# EAGLE design stm32f4discovery-daugherboard (EAGLE 6.2)
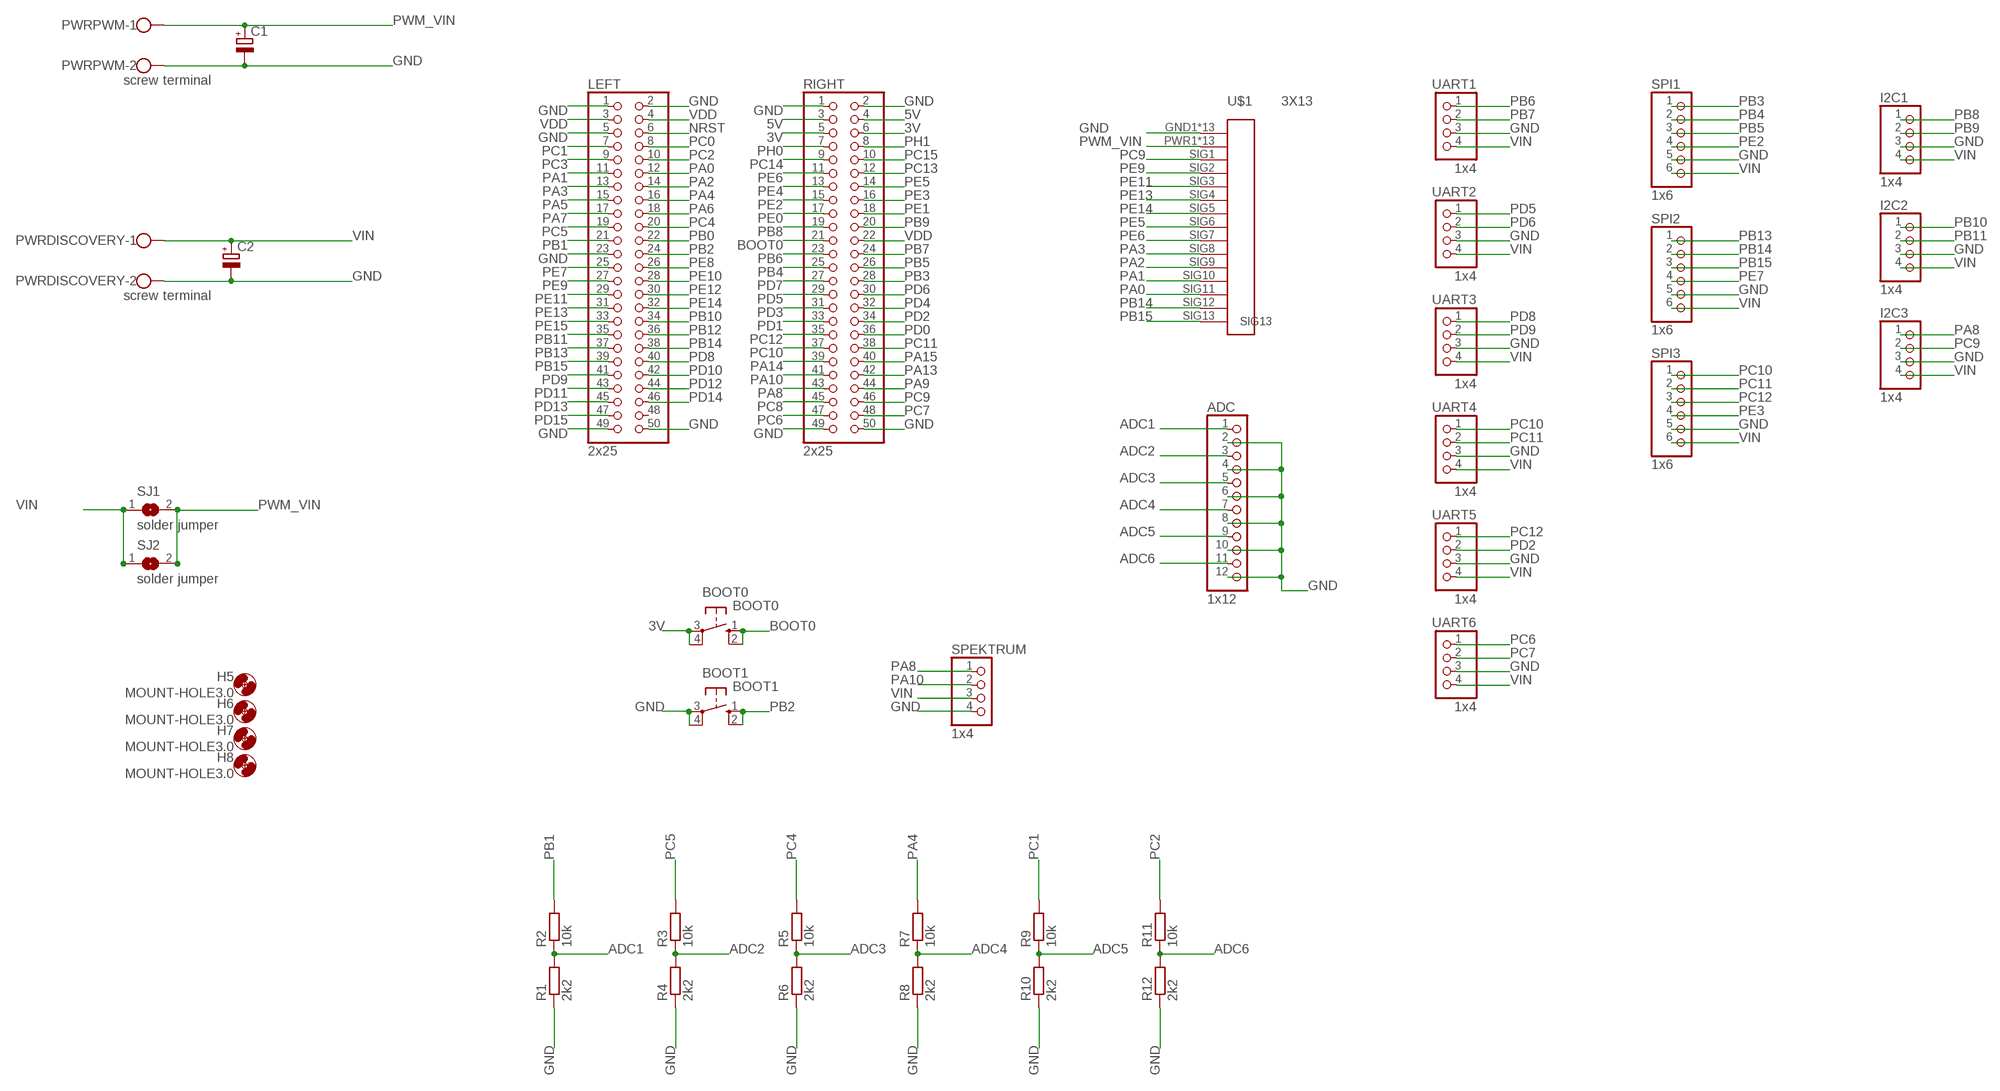
[diagram p0: schematic, sheet 1]

## Parts
ADC  1x12  PINHD-1X12/90  [1X12/90]
BOOT0  BOOT0  10-XX  [B3F-10XX]
BOOT1  BOOT1  10-XX  [B3F-10XX]
C1  CPOL-EU153CLV-0807  [153CLV-0807]
C2  CPOL-EU153CLV-0807  [153CLV-0807]
H5  MOUNT-HOLE3.0  [3,0]
H6  MOUNT-HOLE3.0  [3,0]
H7  MOUNT-HOLE3.0  [3,0]
H8  MOUNT-HOLE3.0  [3,0]
I2C1  1x4  PINHD-1X4/90  [1X04/90]
I2C2  1x4  PINHD-1X4/90  [1X04/90]
I2C3  1x4  PINHD-1X4/90  [1X04/90]
LEFT  2x25  PINHD-2X25  [2X25]
PWRDISCOVERY  screw terminal  W237-102  [W237-102]
PWRPWM  screw terminal  W237-102  [W237-102]
R1  2k2  R-EU_M0805  [M0805]
R2  10k  R-EU_M0805  [M0805]
R3  10k  R-EU_M0805  [M0805]
R4  2k2  R-EU_M0805  [M0805]
R5  10k  R-EU_M0805  [M0805]
R6  2k2  R-EU_M0805  [M0805]
R7  10k  R-EU_M0805  [M0805]
R8  2k2  R-EU_M0805  [M0805]
R9  10k  R-EU_M0805  [M0805]
R10  2k2  R-EU_M0805  [M0805]
R11  10k  R-EU_M0805  [M0805]
R12  2k2  R-EU_M0805  [M0805]
RIGHT  2x25  PINHD-2X25  [2X25]
SJ1  solder jumper  SJW  [SJW]
SJ2  solder jumper  SJW  [SJW]
SPEKTRUM  1x4  PINHD-1X4/90  [1X04/90]
SPI1  1x6  PINHD-1X6/90  [1X06/90]
SPI2  1x6  PINHD-1X6/90  [1X06/90]
SPI3  1x6  PINHD-1X6/90  [1X06/90]
U$1  3X13  [3X13]
UART1  1x4  PINHD-1X4/90  [1X04/90]
UART2  1x4  PINHD-1X4/90  [1X04/90]
UART3  1x4  PINHD-1X4/90  [1X04/90]
UART4  1x4  PINHD-1X4/90  [1X04/90]
UART5  1x4  PINHD-1X4/90  [1X04/90]
UART6  1x4  PINHD-1X4/90  [1X04/90]

## Nets
3V: BOOT0.3(P) BOOT0.4(P1) RIGHT.5 RIGHT.6
5V: RIGHT.3 RIGHT.4
ADC1: ADC.1 R1.2 R2.1
ADC2: ADC.3 R3.1 R4.2
ADC3: ADC.5 R5.1 R6.2
ADC4: ADC.7 R7.1 R8.2
ADC5: ADC.9 R9.1 R10.2
ADC6: ADC.11 R11.1 R12.2
BOOT0: BOOT0.1(S) BOOT0.2(S1) RIGHT.21
GND: ADC.2 ADC.4 ADC.6 ADC.8 ADC.10 ADC.12 BOOT1.3(P) BOOT1.4(P1) C1.- C2.- I2C1.3 I2C2.3 I2C3.3 LEFT.1 LEFT.2 LEFT.5 LEFT.23 LEFT.49 LEFT.50 PWRDISCOVERY.2 PWRPWM.2 R1.1 R4.1 R6.1 R8.1 R10.1 R12.1 RIGHT.1 RIGHT.2 RIGHT.49 RIGHT.50 SPEKTRUM.4 SPI1.5 SPI2.5 SPI3.5 U$1.GND1(GND) U$1.GND2(GND) U$1.GND3(GND) U$1.GND4(GND) U$1.GND5(GND) U$1.GND6(GND) U$1.GND7(GND) U$1.GND8(GND) U$1.GND9(GND) U$1.GND10(GND) U$1.GND11(GND) U$1.GND12(GND) U$1.GND13(GND) UART1.3 UART2.3 UART3.3 UART4.3 UART5.3 UART6.3
NRST: LEFT.6
PA0: LEFT.12 U$1.SIG11
PA1: LEFT.11 U$1.SIG10
PA2: LEFT.14 U$1.SIG9
PA3: LEFT.13 U$1.SIG8
PA4: LEFT.16 R7.2
PA5: LEFT.15
PA6: LEFT.18
PA7: LEFT.17
PA8: I2C3.1 RIGHT.43 SPEKTRUM.1
PA9: RIGHT.44
PA10: RIGHT.41 SPEKTRUM.2
PA13: RIGHT.42
PA14: RIGHT.39
PA15: RIGHT.40
PB0: LEFT.22
PB1: LEFT.21 R2.2
PB2: BOOT1.1(S) BOOT1.2(S1) LEFT.24
PB3: RIGHT.28 SPI1.1
PB4: RIGHT.25 SPI1.2
PB5: RIGHT.26 SPI1.3
PB6: RIGHT.23 UART1.1
PB7: RIGHT.24 UART1.2
PB8: I2C1.1 RIGHT.19
PB9: I2C1.2 RIGHT.20
PB10: I2C2.1 LEFT.34
PB11: I2C2.2 LEFT.35
PB12: LEFT.36
PB13: LEFT.37 SPI2.1
PB14: LEFT.38 SPI2.2 U$1.SIG12
PB15: LEFT.39 SPI2.3 U$1.SIG13
PC0: LEFT.8
PC1: LEFT.7 R9.2
PC2: LEFT.10 R11.2
PC3: LEFT.9
PC4: LEFT.20 R5.2
PC5: LEFT.19 R3.2
PC6: RIGHT.47 UART6.1
PC7: RIGHT.48 UART6.2
PC8: RIGHT.45
PC9: I2C3.2 RIGHT.46 U$1.SIG1
PC10: RIGHT.37 SPI3.1 UART4.1
PC11: RIGHT.38 SPI3.2 UART4.2
PC12: RIGHT.35 SPI3.3 UART5.1
PC13: RIGHT.12
PC14: RIGHT.9
PC15: RIGHT.10
PD0: RIGHT.36
PD1: RIGHT.33
PD2: RIGHT.34 UART5.2
PD3: RIGHT.31
PD4: RIGHT.32
PD5: RIGHT.29 UART2.1
PD6: RIGHT.30 UART2.2
PD7: RIGHT.27
PD8: LEFT.40 UART3.1
PD9: LEFT.41 UART3.2
PD10: LEFT.42
PD11: LEFT.43
PD12: LEFT.44
PD13: LEFT.45
PD14: LEFT.46
PD15: LEFT.47
PE0: RIGHT.17
PE1: RIGHT.18
PE2: RIGHT.15 SPI1.4
PE3: RIGHT.16 SPI3.4
PE4: RIGHT.13
PE5: RIGHT.14 U$1.SIG6
PE6: RIGHT.11 U$1.SIG7
PE7: LEFT.25 SPI2.4
PE8: LEFT.26
PE9: LEFT.27 U$1.SIG2
PE10: LEFT.28
PE11: LEFT.29 U$1.SIG3
PE12: LEFT.30
PE13: LEFT.31 U$1.SIG4
PE14: LEFT.32 U$1.SIG5
PE15: LEFT.33
PH0: RIGHT.7
PH1: RIGHT.8
PWM_VIN: C1.+ PWRPWM.1 SJ1.2 SJ2.2 U$1.PWR1(PWR) U$1.PWR2(PWR) U$1.PWR3(PWR) U$1.PWR4(PWR) U$1.PWR5(PWR) U$1.PWR6(PWR) U$1.PWR7(PWR) U$1.PWR8(PWR) U$1.PWR9(PWR) U$1.PWR10(PWR) U$1.PWR11(PWR) U$1.PWR12(PWR) U$1.PWR13(PWR)
VDD: LEFT.3 LEFT.4 RIGHT.22
VIN: C2.+ I2C1.4 I2C2.4 I2C3.4 PWRDISCOVERY.1 SJ1.1 SJ2.1 SPEKTRUM.3 SPI1.6 SPI2.6 SPI3.6 UART1.4 UART2.4 UART3.4 UART4.4 UART5.4 UART6.4
Unconnected: LEFT.48

## Library data of the parts
ADC = pinhead:PINHD-1X12: PIN HEADER
BOOT0 BOOT1 = switch-omron:10-XX: OMRON SWITCH; MPN: B3F-1000; OC_FARNELL: 176432; OC_NEWARK: 36M3542
C1 C2 = rcl:CPOL-EU: POLARIZED CAPACITOR, European symbol
H5-H8 = holes:MOUNT-HOLE: MOUNTING HOLE with drill center marker
I2C1-I2C3 SPEKTRUM UART1-UART6 = pinhead:PINHD-1X4: PIN HEADER
LEFT RIGHT = pinhead:PINHD-2X25: PIN HEADER
PWRDISCOVERY PWRPWM = con-wago-500:W237-102: WAGO SCREW CLAMP; MPN: 237-102; OC_FARNELL: unknown; OC_NEWARK: 70K9898
R1-R12 = resistor:R-EU_: RESISTOR, European symbol
SJ1 SJ2 = jumper:SJ: SMD solder JUMPER
SPI1-SPI3 = pinhead:PINHD-1X6: PIN HEADER
U$1 = pinhead3:3X13

## Board
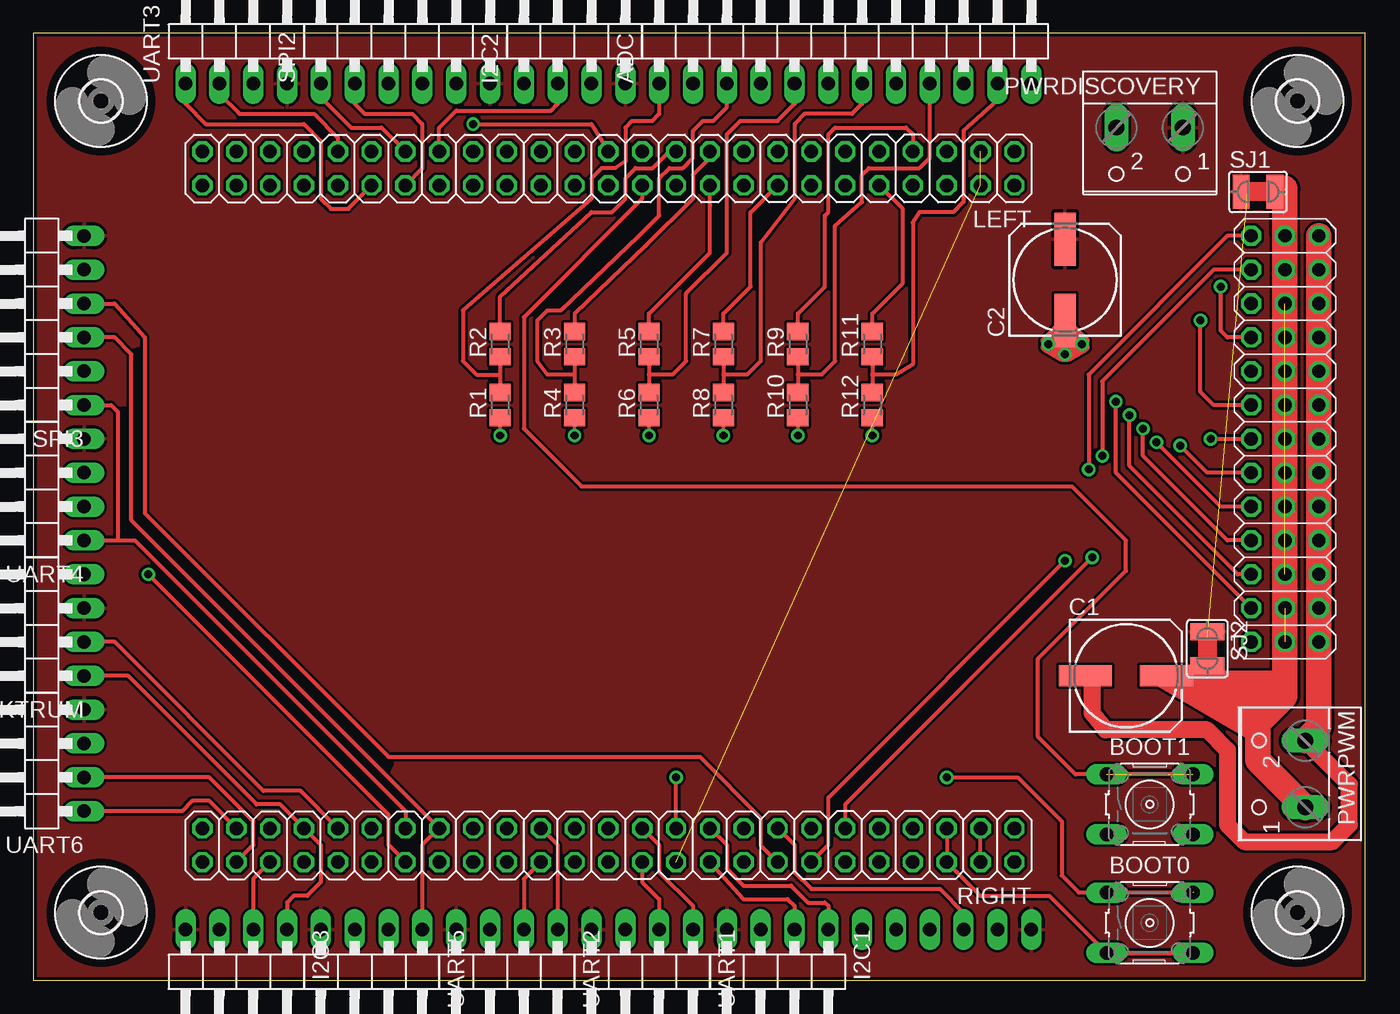
[diagram p1: board, top side]
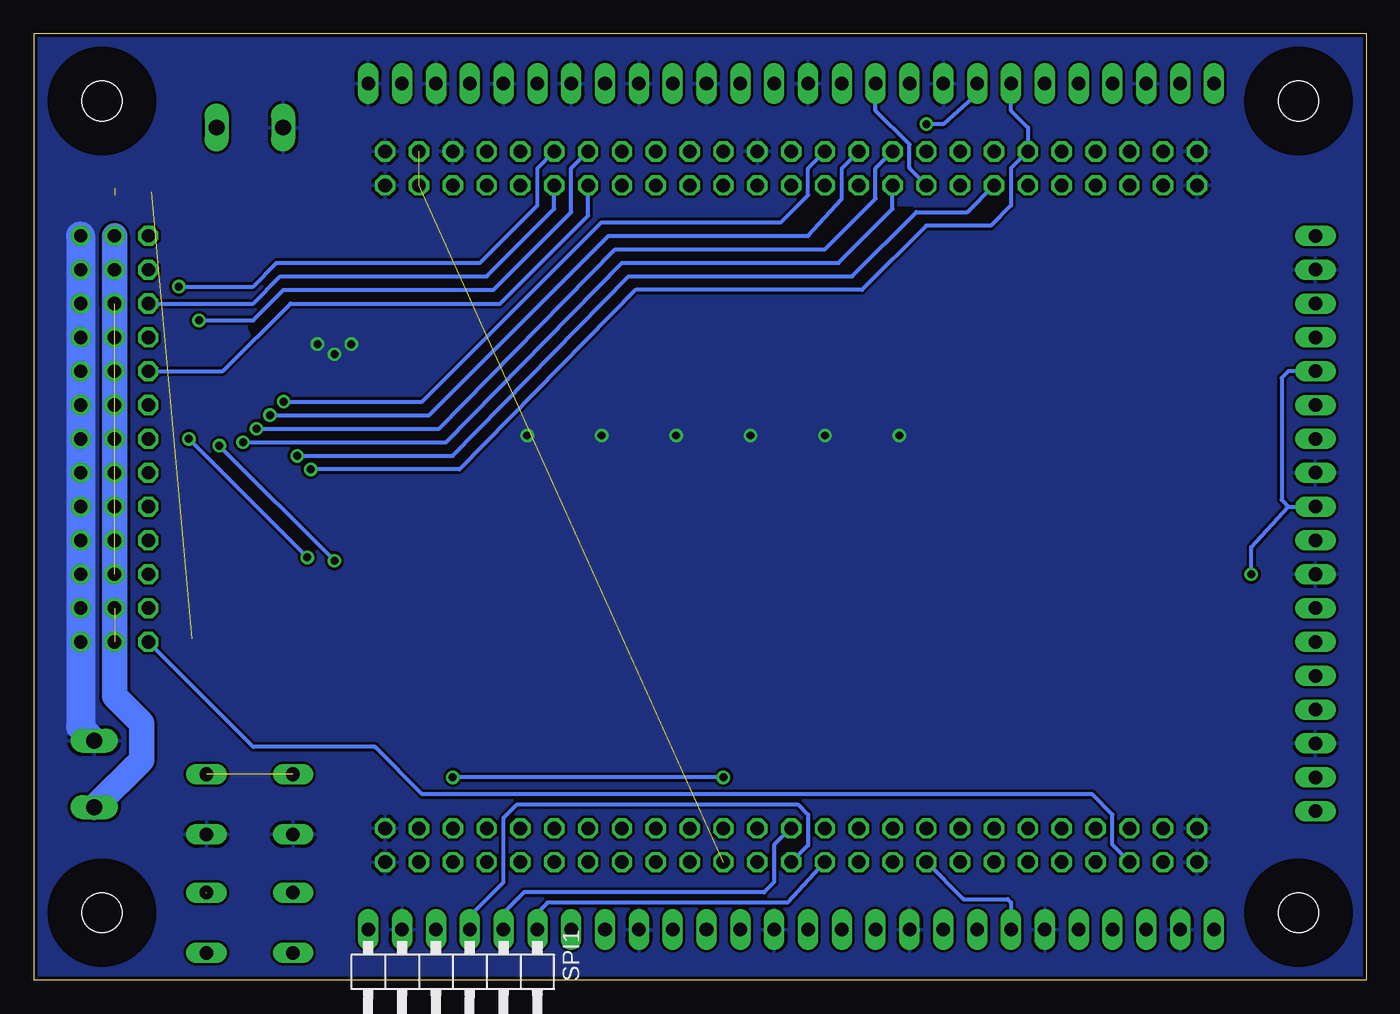
[diagram p2: board, bottom side, seen from below]

Size 100 x 71.08 mm. Coordinates in mm from the lower left corner, seen from the top.
Outline: 0,0 100,0 100,71.08 0,71.08 0,0
Copper layers (1*16): Top 0.035mm / dielectric 1.5mm / Bottom 0.035mm
Design rules: minimum track width 10mil, minimum drill 24mil, track to track 8mil, track to pad 8mil, pad to pad 8mil, via to via 8mil, smd to smd 8mil, copper to edge 10mil, drill to drill 8mil, minimum pad ring 10mil, minimum via ring 8mil, stop-mask expansion 4mil, vias tented up to drill 0mil, thermal gap 10mil

### Footprints (pad centres in the part's own frame; a part is rotated, then mirrored left to right if it is on the bottom)
1X12/90 = drill 1.016 long: 1 -13.97,-3.81; 2 -11.43,-3.81; 3 -8.89,-3.81; 4 -6.35,-3.81; 5 -3.81,-3.81; 6 -1.27,-3.81; 7 1.27,-3.81; 8 3.81,-3.81; 9 6.35,-3.81; 10 8.89,-3.81; 11 11.43,-3.81; 12 13.97,-3.81
B3F-10XX = drill 1.016 long: 1 -3.251,2.261; 2 3.251,2.261; 3 -3.251,-2.261; 4 3.251,-2.261
153CLV-0807 = smd 4 x 1.6: + 3.05,0; - -3.05,0
3,0 = hole 3: 0,0
1X04/90 = drill 1.016 long: 1 -3.81,-3.81; 2 -1.27,-3.81; 3 1.27,-3.81; 4 3.81,-3.81
2X25 = drill 1.016 octagon: 1 -30.48,-1.27; 2 -30.48,1.27; 3 -27.94,-1.27; 4 -27.94,1.27; 5 -25.4,-1.27; 6 -25.4,1.27; 7 -22.86,-1.27; 8 -22.86,1.27; 9 -20.32,-1.27; 10 -20.32,1.27; 11 -17.78,-1.27; 12 -17.78,1.27; 13 -15.24,-1.27; 14 -15.24,1.27; 15 -12.7,-1.27; 16 -12.7,1.27; 17 -10.16,-1.27; 18 -10.16,1.27; 19 -7.62,-1.27; 20 -7.62,1.27; 21 -5.08,-1.27; 22 -5.08,1.27; 23 -2.54,-1.27; 24 -2.54,1.27; 25 0,-1.27; 26 0,1.27; 27 2.54,-1.27; 28 2.54,1.27; 29 5.08,-1.27; 30 5.08,1.27; 31 7.62,-1.27; 32 7.62,1.27; 33 10.16,-1.27; 34 10.16,1.27; 35 12.7,-1.27; 36 12.7,1.27; 37 15.24,-1.27; 38 15.24,1.27; 39 17.78,-1.27; 40 17.78,1.27; 41 20.32,-1.27; 42 20.32,1.27; 43 22.86,-1.27; 44 22.86,1.27; 45 25.4,-1.27; 46 25.4,1.27; 47 27.94,-1.27; 48 27.94,1.27; 49 30.48,-1.27; 50 30.48,1.27
W237-102 = drill 1.194 long: 1 -2.5,-1.27; 2 2.5,-1.27
M0805 = smd 1.3 x 1.6: 1 -0.95,0; 2 0.95,0
SJW = smd 1.27 x 2.54: 1 -1.27,0; 2 1.27,0
1X06/90 = drill 1.016 long: 1 -6.35,-3.81; 2 -3.81,-3.81; 3 -1.27,-3.81; 4 1.27,-3.81; 5 3.81,-3.81; 6 6.35,-3.81
3X13 = drill 1 octagon: GND1 0,-2.54; GND2 2.54,-2.54; GND3 5.08,-2.54; GND4 7.62,-2.54; GND5 10.16,-2.54; GND6 12.7,-2.54; GND7 15.24,-2.54; GND8 17.78,-2.54; GND9 20.32,-2.54; GND10 22.86,-2.54; GND11 25.4,-2.54; GND12 27.94,-2.54; GND13 30.48,-2.54; PWR1 0,0; PWR2 2.54,0; PWR3 5.08,0; PWR4 7.62,0; PWR5 10.16,0; PWR6 12.7,0; PWR7 15.24,0; PWR8 17.78,0; PWR9 20.32,0; PWR10 22.86,0; PWR11 25.4,0; PWR12 27.94,0; PWR13 30.48,0; SIG1 0,2.54; SIG2 2.54,2.54; SIG3 5.08,2.54; SIG4 7.62,2.54; SIG5 10.16,2.54; SIG6 12.7,2.54; SIG7 15.24,2.54; SIG8 17.78,2.54; SIG9 20.32,2.54; SIG10 22.86,2.54; SIG11 25.4,2.54; SIG12 27.94,2.54; SIG13 30.48,2.54

### Placement (x,y rotation side)
ADC  60.96,71.12 0 top
BOOT0  83.82,4.32 0 top
BOOT1  83.82,13.21 0 top
C1  82.04,22.86 0 top
C2  77.47,52.58 90 top
H5  94.92,5.08 0 top
H6  5.08,5.08 0 top
H7  94.92,66 0 top
H8  5.08,66 0 top
I2C1  55.88,0 180 top
I2C2  40.64,71.12 0 top
I2C3  15.24,0 180 top
LEFT  43.18,60.94 180 top
PWRDISCOVERY  83.82,62.74 180 top
PWRPWM  94.23,15.49 90 top
R1  35.05,43.18 90 top
R2  35.05,47.75 90 top
R3  40.64,47.75 90 top
R4  40.64,43.18 90 top
R5  46.23,47.75 90 top
R6  46.23,43.18 90 top
R7  51.82,47.75 90 top
R8  51.82,43.18 90 top
R9  57.4,47.75 90 top
R10  57.4,43.18 90 top
R11  62.99,47.75 90 top
R12  62.99,43.18 90 top
RIGHT  43.18,10.14 180 top
SJ1  91.95,59.18 0 top
SJ2  88.14,24.89 270 top
SPEKTRUM  0,26.67 90 top
SPI1  68.58,0 180 bottom
SPI2  27.94,71.12 0 top
SPI3  0,49.53 90 top
U$1  93.98,25.4 90 top
UART1  45.72,0 180 top
UART2  35.56,0 180 top
UART3  15.24,71.12 0 top
UART4  0,36.83 90 top
UART5  25.4,0 180 top
UART6  0,16.51 90 top

### Tracks (layer width: path | path; a pad name or v marks a point on that pad's centre or on a via)
3V
  Top 0.305: RIGHT.5 RIGHT.6 68.6,8.87 71.12,6.35 76.28,6.35 BOOT0.3 BOOT0.4
5V
  Top 0.305: RIGHT.4 RIGHT.3
ADC1
  Top 0.305: R2.1 35.05,45.47 | 35.05,45.47 R1.2 | ADC.1 46.99,65.02 46.48,64.52 44.96,64.52 44.45,64.01 44.45,61.47 43.69,60.96 42.67,60.96 41.91,60.2 41.91,58.67 34.04,51.82 32.26,50.29 32.26,46.48 33.27,45.47 35.05,45.47
ADC2
  Top 0.305: 40.64,45.47 R4.2 | R3.1 40.64,45.47 | 40.64,45.47 38.61,45.47 37.85,46.48 37.85,49.53 38.61,50.29 39.62,50.29 45.47,55.88 46.99,57.4 46.99,60.2 47.75,60.96 48.77,60.96 49.53,61.72 49.53,63.75 50.29,64.52 51.05,64.52 52.07,65.53 ADC.3
ADC3
  Top 0.305: R5.1 46.23,45.47 | 46.23,45.47 R6.2 | ADC.5 57.15,65.79 55.88,64.52 53.09,64.52 52.07,63.5 52.07,54.61 49.02,51.56 49.02,46.48 48.01,45.47 46.23,45.47
ADC4
  Top 0.305: 51.82,45.47 R7.1 51.88,46.74 | 51.82,45.47 R8.2 | ADC.7 62.23,65.79 61.47,65.02 57.91,65.02 57.15,64.26 57.15,58.67 54.61,55.37 54.61,46.48 53.59,45.47 51.82,45.47
ADC5
  Top 0.305: R9.1 57.4,45.47 | 57.4,45.47 R10.2 | ADC.9 67.31,61.72 66.55,60.96 62.74,60.96 62.23,60.45 62.23,58.42 60.2,56.64 60.2,46.48 59.18,45.47 57.4,45.47
ADC6
  Top 0.305: 62.99,45.47 R11.1 63.06,46.74 | 62.99,45.47 R12.2 | ADC.11 72.39,66.04 69.85,63.75 69.85,58.42 69.09,57.66 66.55,57.66 66.04,56.9 66.04,46.23 64.77,45.47 62.99,45.47
BOOT0  (via drill 0.6)  (1 unrouted)
  Top 0.305: RIGHT.21 v48.26,15.24 | v68.58,15.24 73.91,15.24 77.22,11.94 77.22,7.87 78.49,6.6 80.52,6.6 80.54,6.6 | 80.54,6.6 BOOT0.1 | 80.54,6.6 87.12,6.6
  Bottom 0.305: v48.26,15.24 v68.58,15.24
GND  (via drill 0.6)
  Top 0.254: R1.1 v35.05,40.89 | R4.1 v40.64,40.89 | R6.1 v46.23,40.89 | R8.1 v51.82,40.89 | R10.1 v57.4,40.89 | R12.1 v62.99,40.89
  Top 0.61: C2.- 75.95,48.01 75.95,47.5 77.22,46.74 77.72,46.74 78.99,47.5 78.99,48.01 77.72,49.28 v76.2,47.75 76.45,47.75 76.96,47.24 77.98,47.24 78.49,47.75 77.98,48.26
  Top 1.27: 96.77,56.13 U$1.GND13 | PWRPWM.2 98.81,14.69 98.81,11.68 97.54,10.41 90.93,10.41 89.66,11.68 89.66,17.27 88.14,18.8 80.52,18.8 79.5,20.07 79.5,22.86 C1.-
  Top 1.93: U$1.GND13 U$1.GND2 96.52,19.01 PWRPWM.2
  Bottom 1.93: 96.52,19.05 95.5,18.03
  Bottom 2.184: U$1.GND13 96.52,19.05
  other vias: 77.47,46.99 78.74,47.75
  pour Bottom: 0,0 0,71.12 100.08,71.12 100.08,0
N$1
  Top 0.305: 80.52,2.03 87.12,2.03
N$2
  Top 0.305: 80.77,15.49 87.12,15.49
N$3
  Top 1.27: 84.33,22.86 91.69,18.54 93.73,22.1 86.61,22.1
N$4  (1 unrouted)
  Top 1.422: 92.96,59.18 91.19,59.18 | 88.14,25.65 88.14,23.88
N$5
  Top 1.422: 87.63,21.59 92.71,21.59 92.71,20.83 90.93,20.83 90.93,19.56 90.17,19.81 89.92,20.57 88.9,20.57 88.9,20.83
N$6
  cutout Top: 86.87,25.4 89.41,25.4 89.41,24.38 86.87,24.38
  cutout Top: 91.44,57.91 91.44,60.45 92.46,60.45 92.46,57.91
N$12
  cutout Bottom: 34.04,57.91 35.05,57.91 35.05,57.66 34.29,57.66 34.29,57.91
N$13
  cutout Top: 6.35,42.93 6.86,42.93 6.86,42.67 6.35,42.67
N$14
  cutout Top: 7.62,46.99 8.13,46.99 8.13,47.5 7.37,47.24
N$15
  cutout Top: 26.67,15.75 26.92,16.26 26.67,16.51
N$16
  cutout Bottom: 83.57,48.51 83.82,49.02 83.57,49.28
PA0
  Bottom 0.305: U$1.SIG11 83.57,50.8 81.53,52.83 66.04,52.83 60.96,57.91 LEFT.12
PA1  (via drill 0.6)
  Top 0.305: U$1.SIG10 89.66,48.26 89.15,48.77 v89.15,52.07
  Bottom 0.305: v89.15,52.07 83.57,52.07 81.79,53.85 66.55,53.85 62.23,58.17 62.23,60.94 LEFT.11
PA2
  Bottom 0.305: U$1.SIG9 85.85,45.72 80.77,50.8 65.02,50.8 58.42,57.4 LEFT.14
PA3  (via drill 0.6)
  Top 0.305: U$1.SIG8 88.65,43.18 87.63,44.2 v87.63,49.53
  Bottom 0.305: v87.63,49.53 83.57,49.53 81.28,51.82 65.53,51.82 59.69,57.66 59.69,60.94 LEFT.13
PA4
  Top 0.305: R7.2 51.82,50.04 53.85,52.07 53.85,57.66 53.87,57.66 LEFT.16
PA8
  Top 0.305: SPEKTRUM.1 7.11,22.86 16.76,13.21 18.54,13.21 20.32,11.43 RIGHT.43 20.34,11.41 21.59,10.16 21.59,7.37 20.57,6.35 19.56,6.35 19.05,5.84 I2C3.1
PA10
  Top 0.305: RIGHT.41 22.86,11.43 20.07,14.22 17.27,14.22 6.1,25.4 SPEKTRUM.2
PB1
  Top 0.305: R2.2 35.05,51.31 41.91,57.66 43.43,57.66 44.45,58.67 44.45,60.2 45.21,60.96 46.5,60.96 47.75,62.23 47.77,62.21 LEFT.21
PB2  (1 unrouted)
  Top 0.305: LEFT.24 45.72,58.67 36.83,49.78 36.83,41.4 41.15,37.08 77.98,37.08 82.04,33.02 82.04,30.73 75.44,24.13 75.44,18.29 78.26,15.47 BOOT1.1
PB3
  Bottom 0.305: RIGHT.28 40.66,8.87 43.43,5.84 61.47,5.84 62.23,5.08 SPI1.1
PB4
  Bottom 0.305: RIGHT.25 43.2,11.41 44.45,10.16 44.45,7.37 45.21,6.6 63.25,6.6 64.77,5.08 SPI1.2
PB5
  Bottom 0.305: SPI1.3 67.31,4.83 64.77,7.37 64.77,12.19 63.75,13.21 42.67,13.21 41.91,12.45 41.91,10.14 RIGHT.26
PB6
  Top 0.305: RIGHT.23 45.74,11.41 46.99,10.16 46.99,8.13 49.53,5.59 UART1.1
PB7
  Top 0.305: RIGHT.24 45.72,7.37 46.99,6.1 UART1.2
PB8
  Top 0.305: RIGHT.19 50.82,11.41 52.07,10.16 52.07,8.38 53.34,7.11 56.9,7.11 58.17,5.84 59.44,5.84 59.69,5.59 I2C1.1
PB9
  Top 0.305: RIGHT.20 50.82,8.87 53.34,6.1 56.64,6.1 57.15,5.59 I2C1.2
PB10
  Bottom 0.305: LEFT.34 33.02,59.69 34.29,60.96 34.29,62.74 36.83,65.28 I2C2.1
PB11
  Top 0.305: LEFT.35 30.48,64.01 31.75,65.28 38.86,65.28 39.37,65.79 I2C2.2
PB13
  Top 0.305: SPI2.1 21.59,66.29 23.88,64.01 26.14,64.01 LEFT.37
PB14  (via drill 0.6)
  Top 0.305: SPI2.2 24.13,65.79 24.89,65.02 28.45,65.02 29.21,64.26 29.21,60.94 | 29.21,60.94 LEFT.38 | 29.21,60.94 29.19,60.94 | U$1.SIG12 88.65,53.34 80.26,44.96 v80.26,39.37
  Bottom 0.305: v80.26,39.37 68.58,39.37 55.37,52.83 38.61,52.83 33.78,57.66 29.95,57.66 LEFT.38
PB15  (via drill 0.6)
  Top 0.305: U$1.SIG13 89.66,55.88 79.25,45.47 v79.25,38.35
  Bottom 0.305: LEFT.39 25.4,62.23 | SPI2.3 26.67,65.28 25.4,64.01 25.4,62.23 | 25.4,62.23 26.67,60.96 26.67,58.17 28.19,56.64 33.02,56.64 37.85,51.82 54.86,51.82 68.07,38.35 v79.25,38.35
PC1
  Top 0.305: 66.02,62.21 LEFT.7 66.04,63.5 65.53,64.01 60.2,64.01 59.69,63.5 59.69,57.66 59.44,57.4 59.44,52.07 57.4,50.04 R9.2
PC2
  Top 0.305: R11.2 62.99,50.04 65.28,52.32 65.28,57.91 LEFT.10
PC4
  Top 0.305: R5.2 46.23,50.04 50.8,54.61 50.8,58.17 50.82,58.17 LEFT.20
PC5
  Top 0.305: LEFT.19 50.78,61.7 49.53,60.45 49.53,58.67 45.97,55.12 40.64,50.04 R3.2
PC6
  Top 0.305: RIGHT.47 15.24,11.43 13.21,13.46 11.94,13.46 11.18,12.7 UART6.1
PC7
  Top 0.305: RIGHT.48 15.24,8.89 16.51,10.16 16.51,11.94 13.21,15.24 UART6.2
PC9
  Top 0.305: RIGHT.46 17.76,8.87 16.51,7.62 I2C3.2
  Bottom 0.305: RIGHT.46 17.78,8.89 19.05,10.16 19.05,12.45 20.57,13.97 70.87,13.97 74.42,17.53 83.57,17.53 U$1.SIG1
PC10
  Top 0.305: UART4.1 6.35,33.02 | 6.35,33.02 7.62,33.02 27.94,12.7 RIGHT.37 | SPI3.1 5.84,43.18 6.35,42.67 6.35,33.02
PC11  (via drill 0.6)
  Top 0.305: RIGHT.38 27.94,8.89 26.67,10.16 26.67,12.45 v8.64,30.48
  Bottom 0.305: v8.64,30.48 8.64,32.51 5.84,35.56 | 5.84,35.56 UART4.2 | SPI3.2 5.84,45.72 6.35,45.21 6.35,36.07 5.84,35.56
PC12
  Top 0.305: UART5.1 29.21,10.16 30.46,11.41 RIGHT.35 30.48,11.43 7.37,34.54 7.37,46.99 6.1,48.26 SPI3.3
PD2
  Bottom 0.305: RIGHT.34 33,8.87 30.23,6.1 26.92,6.1 26.67,5.84 UART5.2
PD5
  Top 0.305: RIGHT.29 38.12,11.41 39.37,10.16 UART2.1
PD6
  Top 0.305: RIGHT.30 38.08,8.87 36.83,7.62 UART2.2
PD8
  Top 0.305: UART3.1 11.43,65.79 12.95,64.26 20.32,64.26 21.59,62.99 21.59,58.67 22.35,57.91 23.64,57.91 LEFT.40
PD9
  Top 0.305: UART3.2 13.97,66.55 15.49,65.02 21.08,65.02 22.86,63.25 LEFT.41
PE2
  Top 0.305: RIGHT.15 55.9,11.41 57.15,10.16 57.15,8.13 58.42,6.86 68.07,6.86 69.85,5.08 SPI1.4
PE3
  Top 0.305: SPI3.4 6.1,50.8 8.38,48.26 8.38,35.05 26.67,16.76 50.04,16.76 54.61,12.19 54.61,10.14 RIGHT.16
PE5  (via drill 0.6)
  Top 0.305: RIGHT.14 58.42,8.89 59.69,10.16 59.69,13.72 v77.47,31.5 | U$1.SIG6 88.14,38.1 v86.11,40.13
  Bottom 0.305: v86.11,40.13 v77.47,31.5
PE6  (via drill 0.6)
  Top 0.305: RIGHT.11 60.96,13.21 v79.5,31.75 | v88.39,40.64 U$1.SIG7
  Bottom 0.305: v79.5,31.75 v88.39,40.64
PE7  (via drill 0.6)
  Top 0.305: v33.02,64.26 41.91,64.26 LEFT.25
  Bottom 0.305: SPI2.4 29.21,66.55 31.75,64.26 v33.02,64.26
PE9  (via drill 0.6)
  Top 0.305: U$1.SIG2 81.28,38.1 v81.28,43.43
  Bottom 0.305: v81.28,43.43 70.87,43.43 57.4,56.9 43.94,56.9 41.91,58.93 41.91,60.94 LEFT.27
PE11  (via drill 0.6)
  Top 0.305: U$1.SIG3 90.42,30.48 82.3,38.61 v82.3,42.42
  Bottom 0.305: v82.3,42.42 70.36,42.42 56.9,55.88 41.91,55.88 39.37,58.67 39.37,60.94 LEFT.29
PE13  (via drill 0.6)
  Top 0.305: U$1.SIG4 89.66,33.02 83.31,39.37 v83.31,41.4
  Bottom 0.305: v83.31,41.4 69.6,41.4 56.39,54.86 40.64,54.86 36.83,58.67 36.83,60.94 LEFT.31
PE14  (via drill 0.6)
  Top 0.305: U$1.SIG5 89.15,35.56 v84.33,40.39
  Bottom 0.305: v84.33,40.39 69.09,40.39 55.88,53.85 39.62,53.85 35.56,57.91 LEFT.32
PWM_VIN  (10 unrouted)
  Top 0.813: 93.98,22.86 C1.+ SJ2.2
  Top 1.27: SJ1.2 93.98,58.93
  Top 1.93: 93.98,59.44 U$1.PWR13 U$1.PWR12 U$1.PWR11 U$1.PWR1 93.98,22.86 93.98,21.34 91.95,19.3 91.95,16.55 91.95,16.51 95.5,12.95
  Bottom 1.93: U$1.PWR11 U$1.PWR13 93.98,21.34 91.95,19.3 91.95,16.51 PWRPWM.1
VDD  (2 unrouted)
VIN
  pour Top (rank 2): 0,0 0,71.12 100.08,71.12 100.08,0